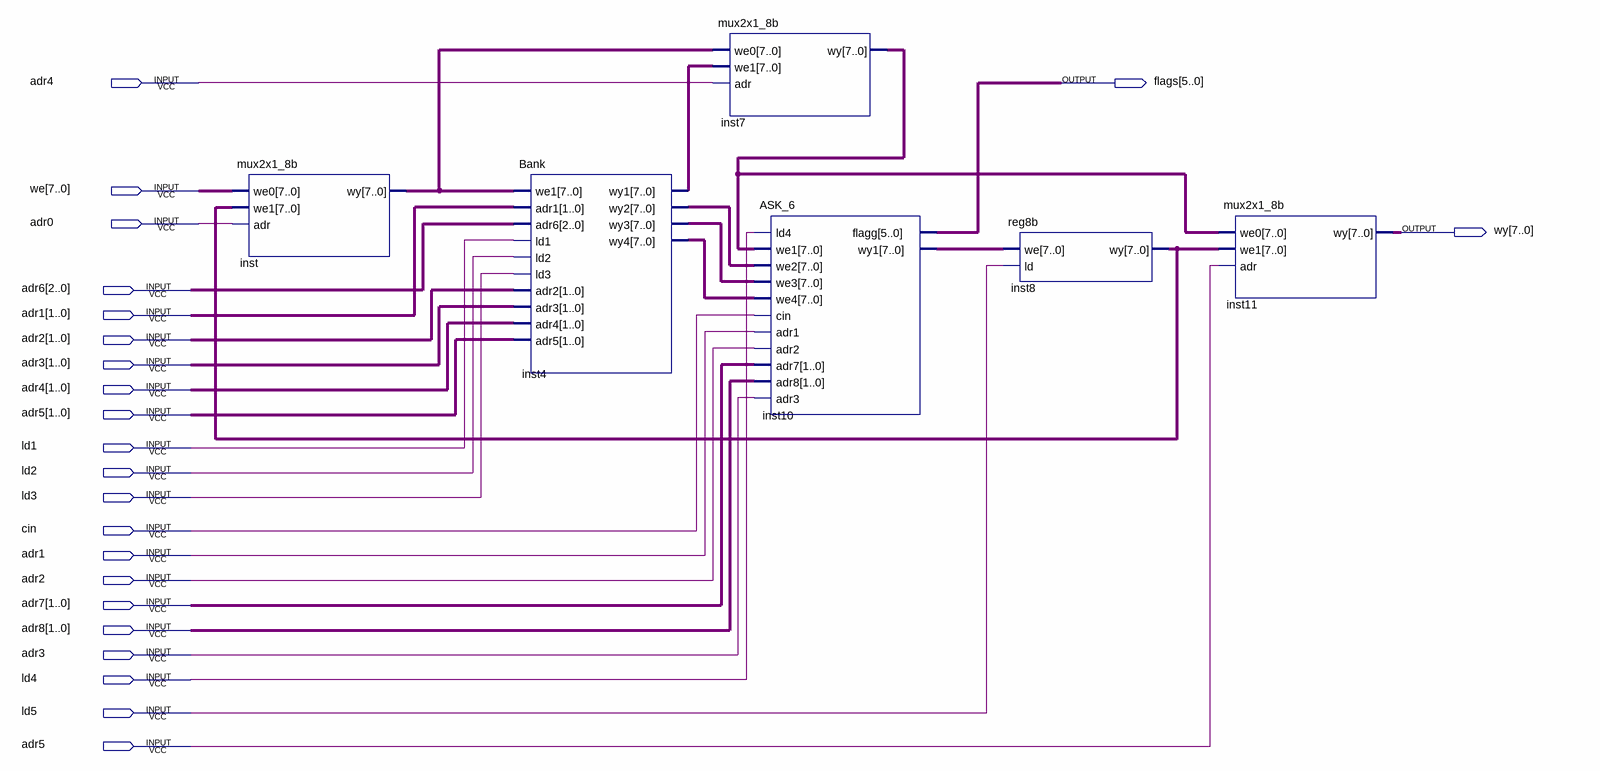
[diagram p0: schematic sheet]
// Quartus schematic Wykonawczy.bdf as structural Verilog: 6 symbols, 23 pins
module Wykonawczy (
  input  adr4_1bit,
  input  [7:0] we,
  input  adr0,
  input  [2:0] adr6,
  input  [1:0] adr1,
  input  [1:0] adr2,
  input  [1:0] adr3,
  input  [1:0] adr4,
  input  [1:0] adr5,
  input  ld1,
  input  ld2,
  input  ld3,
  input  cin,
  input  adr1_1bit,
  input  adr2_1bit,
  input  [1:0] adr7,
  input  [1:0] adr8,
  input  adr3_1bit,
  input  ld4,
  input  ld5,
  input  adr5_1bit,
  output [5:0] flags,
  output [7:0] wy
);

  wire [7:0] inst4_wy1, inst4_wy2, inst4_wy3, inst4_wy4, inst7_wy, inst8_wy, inst10_wy1, inst_wy;

  mux2x1_8b inst (.we0(we), .we1(inst8_wy), .adr(adr0), .wy(inst_wy));
  Bank inst4 (
    .we1(inst_wy), .adr1(adr1), .adr6(adr6), .ld1(ld1), .ld2(ld2), .ld3(ld3), .adr2(adr2), .adr3(adr3),
    .adr4(adr4), .adr5(adr5), .wy1(inst4_wy1), .wy2(inst4_wy2), .wy3(inst4_wy3), .wy4(inst4_wy4));
  mux2x1_8b inst7 (.we0(inst_wy), .we1(inst4_wy1), .adr(adr4_1bit), .wy(inst7_wy));
  ASK_6 inst10 (
    .ld4(ld4), .we1(inst7_wy), .we2(inst4_wy2), .we3(inst4_wy3), .we4(inst4_wy4), .cin(cin),
    .adr1(adr1_1bit), .adr2(adr2_1bit), .adr7(adr7), .adr8(adr8), .adr3(adr3_1bit), .flagg(flags),
    .wy1(inst10_wy1));
  reg8b inst8 (.we(inst10_wy1), .ld(ld5), .wy(inst8_wy));
  mux2x1_8b inst11 (.we0(inst7_wy), .we1(inst8_wy), .adr(adr5_1bit), .wy(wy));
endmodule
